# Altium schematic sheet Controller_1.SchDoc
size A3
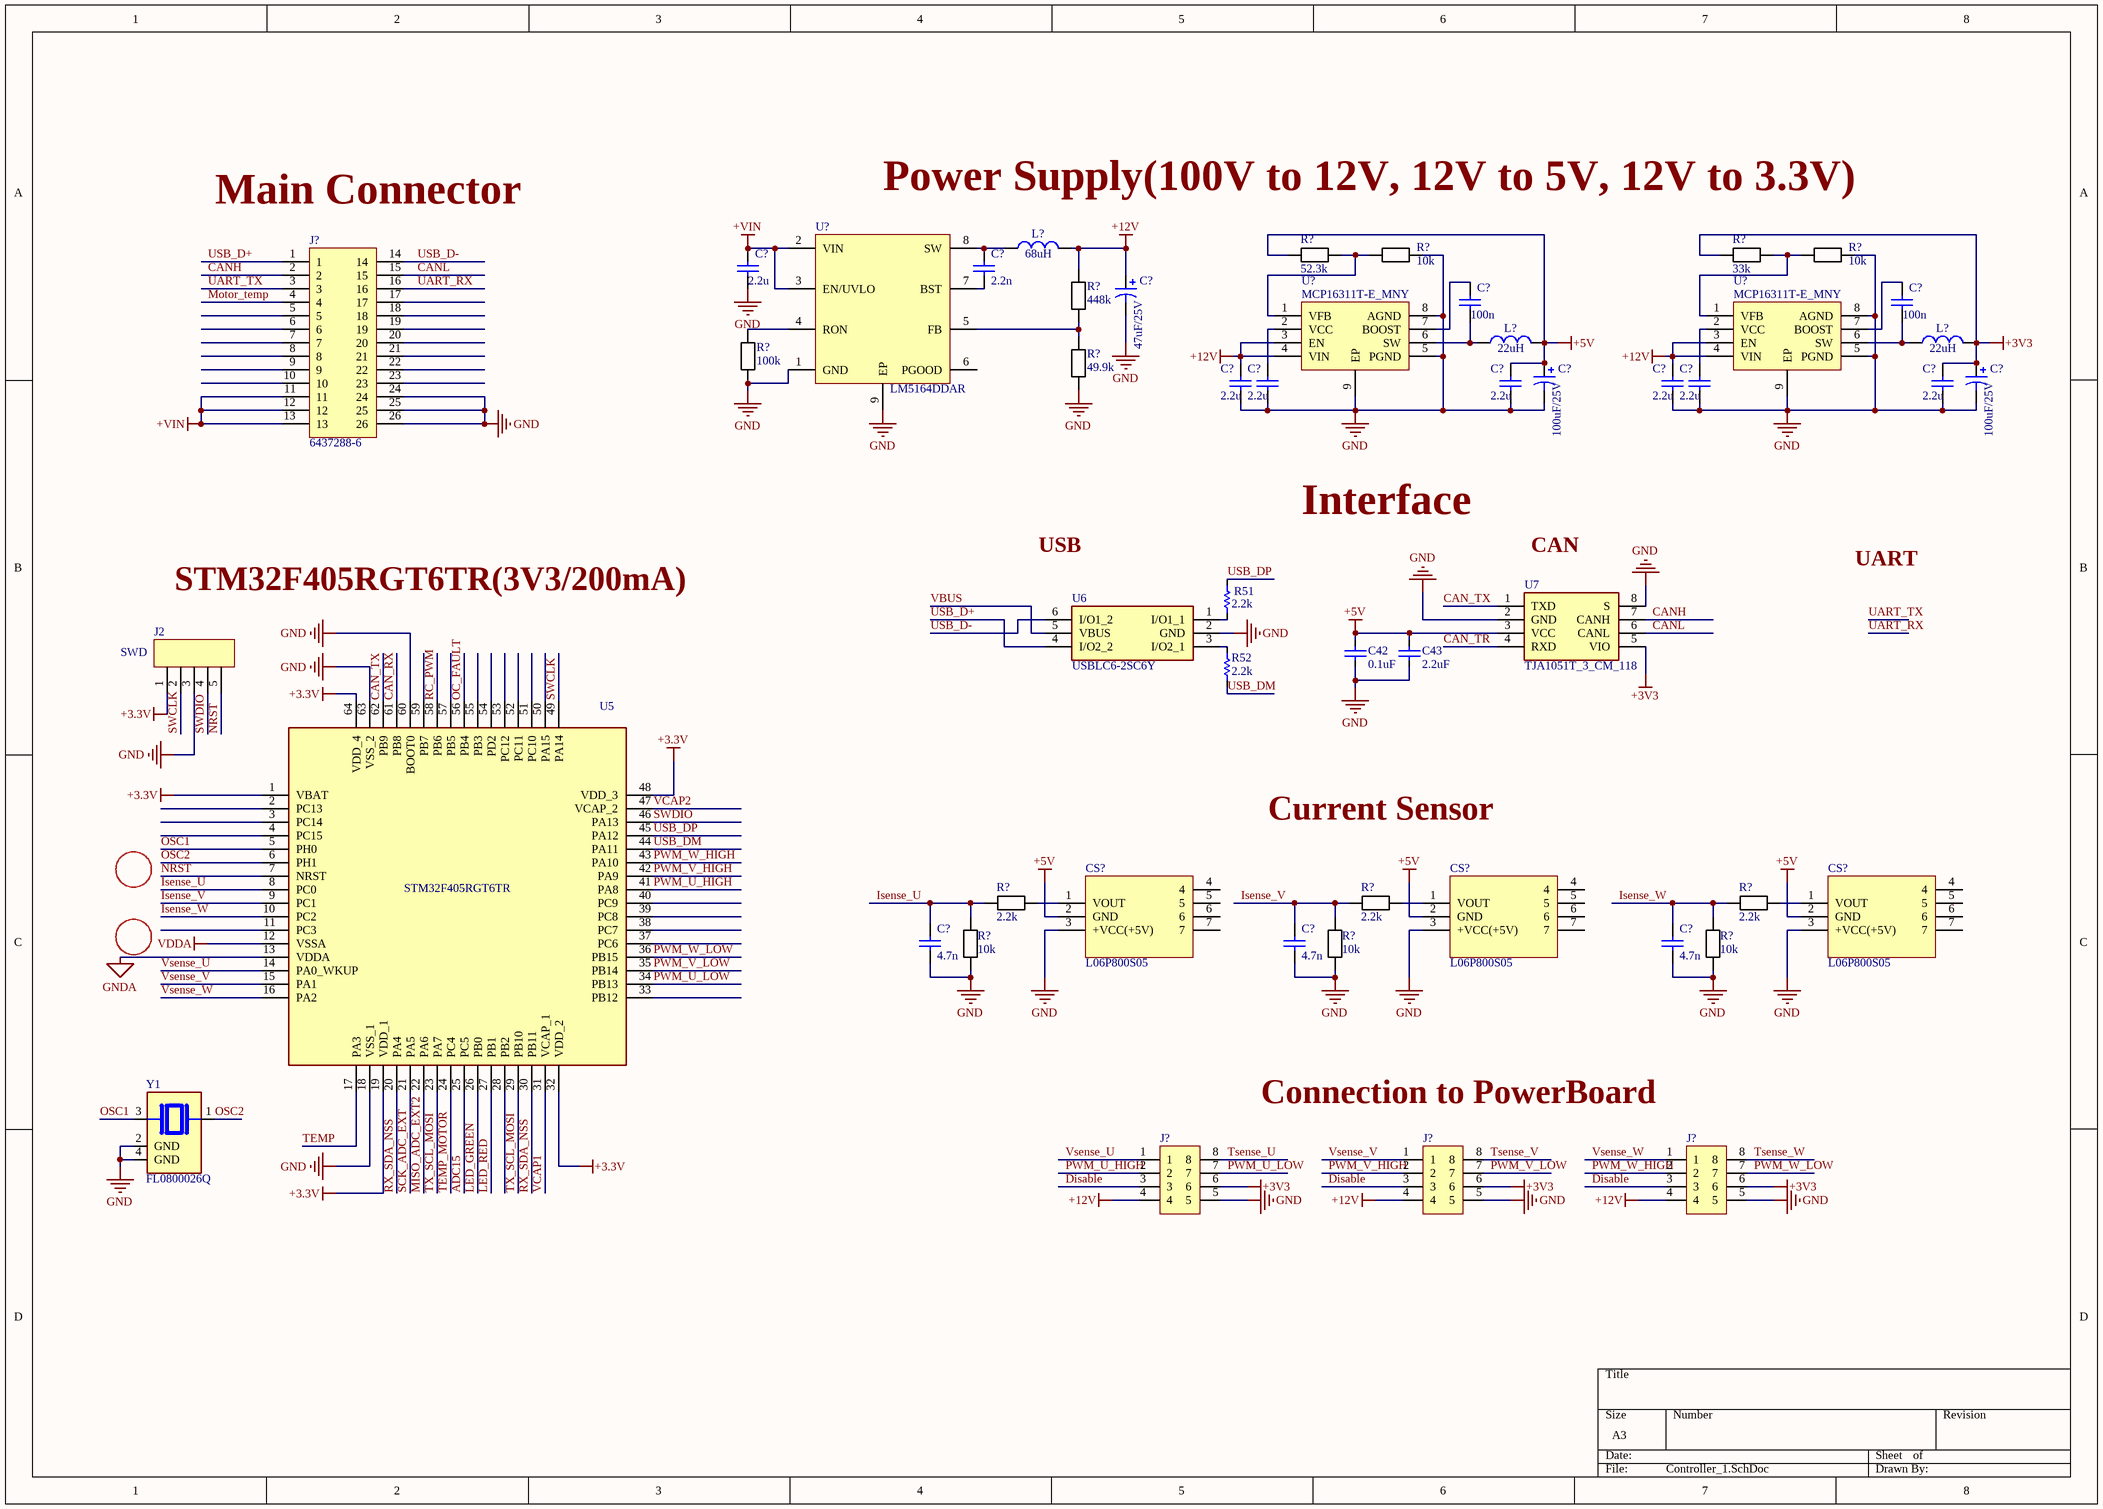
[diagram p0: Controller_1.SchDoc]

## Parts
(Parts that share a designator on the sheet are numbered #1, #2 ... from top to bottom, then left to right.)
C42  0.1uF  [SMD_C(0402)]
C43  2.2uF  [SMD_C(0603)]
C?#1  2.2u  [*]
C?#2  2.2n  [C0603]
C?#3  100n  [C0603]
C?#4  100n  [C0603]
C?#5  47uF/25V  [*]
C?#6  2.2u  [*]
C?#7  2.2u  [*]
C?#8  2.2u  [*]
C?#9  2.2u  [*]
C?#10  2.2u  [*]
C?#11  2.2u  [*]
C?#12  100uF/25V  [*]
C?#13  100uF/25V  [*]
C?#14  4.7n  [C0603]
C?#15  4.7n  [C0603]
C?#16  4.7n  [C0603]
CS?#1  L06P800S05  [L06P800S05]
CS?#2  L06P800S05  [L06P800S05]
CS?#3  L06P800S05  [L06P800S05]
J2  SWD  [Header-2.54m-5pin]
J?#1  6437288-6  [64372886]
J?#2  (no value)  [*]
J?#3  (no value)  [*]
J?#4  (no value)  [*]
L?#1  68uH  [*]
L?#2  22uH  [*]
L?#3  22uH  [*]
R51  2.2k  [SMD_R(0402)]
R52  2.2k  [SMD_R(0402)]
R?#1  52.3k  [R0603]
R?#2  33k  [R0603]
R?#3  448k  [R0603]
R?#4  10k  [R0603]
R?#5  10k  [R0603]
R?#6  100k  [R0603]
R?#7  49.9k  [R0603]
R?#8  2.2k  [R0603]
R?#9  2.2k  [R0603]
R?#10  2.2k  [R0603]
R?#11  10k  [R0603]
R?#12  10k  [R0603]
R?#13  10k  [R0603]
U5  STM32F405RGT6TR  [QFP50P1200X1200X160-64N]
U6  USBLC6-2SC6Y  [SOT95P280X145-6N]
U7  TJA1051T_3_CM_118  [SOIC127P600X175-8N]
U?#1  MCP16311T-E_MNY  [MSOP-8]
U?#2  MCP16311T-E_MNY  [MSOP-8]
U?#3  LM5164DDAR  [SOIC-8(EPAD)]
Y1  FL0800026Q  [XTAL_FL0800026Q]

## Nets
+3.3V: J2.1 U5.1(VBAT) U5.19(VDD_1) U5.32(VDD_2) U5.48(VDD_3) U5.64(VDD_4)
+3V3: C?#11.2 C?#13.1 J?#2.6 J?#3.6 J?#4.6 L?#3.2 R?#2.1 U7.5(VIO)
+5V: C42.2 C43.2 C?#8.2 C?#12.1 CS?#1.2(GND) CS?#2.2(GND) CS?#3.2(GND) L?#2.2 R?#1.1 U7.3(VCC)
+12V: C?#5.1 C?#6.2 C?#9.2 J?#2.4 J?#3.4 J?#4.4 L?#1.2 R?#3.2 U?#1.3(EN) U?#1.4(VIN) U?#2.3(EN) U?#2.4(VIN)
+VIN: C?#1.2 J?#1.11 J?#1.12 J?#1.13 U?#3.2(VIN) U?#3.3(EN/UVLO)
GND: C42.1 C43.1 C?#1.1 C?#5.2 C?#6.1 C?#7.1 C?#8.1 C?#9.1 C?#10.1 C?#11.1 C?#12.2 C?#13.2 C?#14.1 C?#15.1 C?#16.1 CS?#1.3(+VCC(+5V)) CS?#2.3(+VCC(+5V)) CS?#3.3(+VCC(+5V)) J2.3 J?#1.24 J?#1.25 J?#1.26 J?#2.5 J?#3.5 J?#4.5 R?#4.1 R?#5.1 R?#6.1 R?#7.1 R?#11.1 R?#12.1 R?#13.1 U5.18(VSS_1) U5.60(BOOT0) U5.63(VSS_2) U6.2(GND) U7.2(GND) U7.8(S) U?#1.5(PGND) U?#1.8(AGND) U?#1.9(EP) U?#2.5(PGND) U?#2.8(AGND) U?#2.9(EP) U?#3.1(GND) U?#3.9(EP) Y1.2(GND) Y1.4(GND)
GNDA: U5.13(VDDA)
VDDA: U5.12(VSSA)
ADC15: U5.25(PC5)
CAN_RX: U5.61(PB8)
CAN_TR: U7.4(RXD)
CAN_TX: U5.62(PB9) U7.1(TXD)
CANH: J?#1.2 U7.7(CANH)
CANL: J?#1.15 U7.6(CANL)
Disable: J?#2.3 J?#3.3 J?#4.3
Isense_U: C?#14.2 R?#8.1 R?#11.2 U5.8(PC0)
Isense_V: C?#15.2 R?#9.1 R?#12.2 U5.9(PC1)
Isense_W: C?#16.2 R?#10.1 R?#13.2 U5.10(PC2)
LED_GREEN: U5.26(PB0)
LED_RED: U5.27(PB1)
MISO_ADC_EXT2: U5.22(PA6)
Motor_temp: J?#1.4
NRST: J2.5 U5.7(NRST)
OC_FAULT: U5.56(PB4)
OSC1: U5.5(PH0) Y1.3
OSC2: U5.6(PH1) Y1.1
PWM_U_HIGH: J?#2.2 U5.41(PA8)
PWM_U_LOW: J?#2.7 U5.34(PB13)
PWM_V_HIGH: J?#3.2 U5.42(PA9)
PWM_V_LOW: J?#3.7 U5.35(PB14)
PWM_W_HIGH: J?#4.2 U5.43(PA10)
PWM_W_LOW: J?#4.7 U5.36(PB15)
RC_PWM: U5.58(PB6)
RX_SDA_NSS: U5.20(PA4) U5.30(PB11)
SCK_ADC_EXT: U5.21(PA5)
SWCLK: J2.2 U5.49(PA14)
SWDIO: J2.4 U5.46(PA13)
TEMP: U5.17(PA3)
TEMP_MOTOR: U5.24(PC4)
Tsense_U: J?#2.8
Tsense_V: J?#3.8
Tsense_W: J?#4.8
TX_SCL_MOSI: U5.23(PA7) U5.29(PB10)
UART_RX: J?#1.16
UART_TX: J?#1.3
USB_D+: J?#1.1 U6.4(I/O2_2)
USB_D-: J?#1.14 U6.6(I/O1_2)
USB_DM: R52.2 U5.44(PA11)
USB_DP: R51.2 U5.45(PA12)
VBUS: U6.5(VBUS)
VCAP1: U5.31(VCAP_1)
VCAP2: U5.47(VCAP_2)
Vsense_U: J?#2.1 U5.14(PA0_WKUP)
Vsense_V: J?#3.1 U5.15(PA1)
Vsense_W: J?#4.1 U5.16(PA2)
NetC?#2_1: C?#2.1 U?#3.7(BST)
NetC?#2_2: C?#2.2 L?#1.1 U?#3.8(SW)
NetC?#3_1: C?#3.1 L?#2.1 U?#1.6(SW)
NetC?#3_2: C?#3.2 U?#1.7(BOOST)
NetC?#4_1: C?#4.1 L?#3.1 U?#2.6(SW)
NetC?#4_2: C?#4.2 U?#2.7(BOOST)
NetC?#7_2: C?#7.2 U?#1.2(VCC)
NetC?#10_2: C?#10.2 U?#2.2(VCC)
NetCS?#1_1: CS?#1.1(VOUT) R?#8.2
NetCS?#2_1: CS?#2.1(VOUT) R?#9.2
NetCS?#3_1: CS?#3.1(VOUT) R?#10.2
NetR51_1: R51.1 U6.1(I/O1_1)
NetR52_1: R52.1 U6.3(I/O2_1)
NetR?#1_2: R?#1.2 R?#4.2 U?#1.1(VFB)
NetR?#2_2: R?#2.2 R?#5.2 U?#2.1(VFB)
NetR?#3_1: R?#3.1 R?#7.2 U?#3.5(FB)
NetR?#6_2: R?#6.2 U?#3.4(RON)

Not connected (* = marked no-connect by the designer): CS?#1 4 5 6 7; CS?#2 4 5 6 7; CS?#3 4 5 6 7; J?#1 5 6 7 8 9 10 17 18 19 20 21 22 23; U5 2(PC13) 3(PC14) 4(PC15) 11(PC3) 28(PB2) 33(PB12) 37(PC6) 38(PC7) 39(PC8) 40(PC9) 50(PA15) 51(PC10) 52(PC11) 53(PC12) 54(PD2) 55(PB3) 57(PB5) 59(PB7); U?#3 6(PGOOD)

## Notes on the sheet
- (near J?#1) Main Connector
- Power Supply(100V to 12V, 12V to 5V, 12V to 3.3V)
- USB
- Interface
- (near U7) CAN
- UART
- STM32F405RGT6TR(3V3/200mA)
- Current Sensor
- (near J?#3) Connection to PowerBoard

## Library data of the parts
C42 = Cap_1: Multilayer Ceramic Capacitors MLCC - SMD/SMT 50 V 0.1uF X7R 0603 10%; Manufacturer: Yageo; Manufacturer Part Number: CC0603KPX7R9BB104; Supplier 1: Digi-Key; Supplier Part Number 1: 311-3567-1-ND
C43 = Cap_4: Multilayer Ceramic Capacitors MLCC - SMD/SMT 2.2 uF 50 VDC 10% 1206 X7R AEC-Q200; Manufacturer: Yageo; Manufacturer Part Number: GCM31CR71H225KA55K; Supplier 1: Digi-Key; Supplier Part Number 1: 311-3567-1-ND
C?#1 = 2.2uF ± 10% 100V: Value: 2.2u
C?#2 = 2.2nF ± 10% 50V: Manufacturer: Yageo; Price: 0.1; Supplier: Mouser; Value: 2.2n
C?#3 C?#4 = 100nF ± 10% 50V: Manufacturer: Yageo; Manufacturer Part Number: CC0603KRX7R9BB104; Supplier Part Number: 603-CC603KRX7R9BB104; Price: 0.1; Supplier: Mouser; Value: 100n
C?#5 = Cap Pol1: 47uF ±20% 25V; Value: 47uF/25V
C?#6-C?#11 = 2.2uF ± 10% 25V: Value: 2.2u
C?#12 C?#13 = Cap Pol1: 100uF ±20% 25V; Value: 100uF/25V
C?#14-C?#16 = 4.7nF ± 10% 50V: Manufacturer: Yageo; Price: 0.1; Supplier: Mouser; Value: 4.7n
CS?#1-CS?#3 = L06P800S05: Board Mount Current Sensors Current Sensor, +/-800A, +5VDC, PCB, Open Loop, Aperture, 2.5V+/-1.5V Output; Manufacturer: Tamura; Supplier Part Number: 838-L06P800S05; Price: 20; Manufacturer Part Number: L06P800S05; Value: L06P800S05; Supplier: Mouser
J2 = 5PinConnector
J?#1 = 6437288-6: Header vert 26 way 4 row Tab Superseal; Manufacturer: TE Connectivity; Supplier Part Number: 571-6437288-6; Manufacturer Part Number: 6437288-6; Supplier: Mouser; Value: 6437288-6
J?#2-J?#4 = PCB Header: 2 Row 2.54mm Pitch 8 pins
L?#1-L?#3 = Inductor
  L?#1: Value: 68uH
  L?#2 L?#3: Value: 22uH
R51 R52 = Res Semi_2: CRCW04024R02FKED; Published: 8-Jun-2000; LatestRevisionDate: 17-Jul-2002; LatestRevisionNote: Re-released for DXP Platform.; PackageReference: AXIAL-0.5; Publisher: Altium Limited; PackageDescription: Axial Device, Thru-Hole; 2 Leads; 0.5 in Pin Spacing
R?#1 = 52.3 kohm 0.1W ±1%: Manufacturer Part Number: RC0603FR-0752K3L; Manufacturer: Yageo; Value: 52.3k; Supplier: Mouser; Supplier Part Number: 603-RC0603FR-0752K3L; Price: 0.1
R?#2 = 33 kohm 0.1W ±1%: Manufacturer Part Number: RC0603FR-0733KL; Manufacturer: Yageo; Value: 33k; Supplier: Mouser; Supplier Part Number: 603-RC0603FR-0733KL; Price: 0.1
R?#3 = 448 kohm 0.1W ±1%: Manufacturer Part Number: RC0603FR-07448KL; Manufacturer: Yageo; Value: 448k; Supplier: Mouser; Supplier Part Number: 603-RC0603FR-07448KL; Price: 0.1
R?#4 R?#5 R?#11-R?#13 = 10 kohm 0.1W ±1%: Manufacturer Part Number: RC0603FR-0710KL; Manufacturer: Yageo; Value: 10k; Supplier: Mouser; Supplier Part Number: 603-RC0603FR-0710KL; Price: 0.1
R?#6 = 100 kohm 0.1W ±1%: Manufacturer Part Number: RC0603FR-07100KL; Manufacturer: Yageo; Value: 100k; Supplier: Mouser; Supplier Part Number: 603-RC0603FR-07100KL; Price: 0.1
R?#7 = 49.9 kohm 0.1W ±1%: Manufacturer Part Number: RC0603FR-0749K9L; Manufacturer: Yageo; Value: 49.9k; Supplier: Mouser; Supplier Part Number: 603-RC0603FR-0749K9L; Price: 0.1
R?#8-R?#10 = 2.2 kohm 0.1W ±1%: Manufacturer Part Number: RC0603FR-072K2L; Manufacturer: Yageo; Value: 2.2k; Supplier: Mouser; Supplier Part Number: 603-RC0603FR-072K2L; Price: 0.1
U5 = STM32F405RGT6TR: STM32F405RGT6TR, 32 bit ARM Cortex M4 MCU 168MHz 1024 kB Flash, 192 kB RAM, 2xUSB CAN I2C 64-Pin LQFP; Manufacturer_Name: STMicroelectronics; Geometry.Height: 1.6mm; Mouser Part Number: 511-STM32F405RGT6TR; Mouser Price/Stock: https://www.mouser.co.uk/ProductDetail/STMicroelectronics/STM32F405RGT6TR?qs=MavH1QghrkHshpR6GkvPIg%3D%3D; Manufacturer_Part_Number: STM32F405RGT6TR; Datasheet Link: http://www.st.com/web/en/resource/technical/document/datasheet/DM00037051.pdf
U6 = USBLC6-2SC6Y: Low Cap. ESD Protection Auto SOT-23-6 STMicroelectronics USBLC6-2SC6Y, Dual Uni-Directional TVS Diode Array, 6-Pin SOT-23; Geometry.Height: 1.45mm; Mouser Part Number: 511-USBLC6-2SC6Y; Mouser Price/Stock: https://www.mouser.co.uk/ProductDetail/STMicroelectronics/USBLC6-2SC6Y?qs=gNDSiZmRJS%2FOgDexvXkdow%3D%3D; Manufacturer_Name: STMicroelectronics; Manufacturer_Part_Number: USBLC6-2SC6Y; Datasheet Link: https://componentsearchengine.com/Datasheets/1/USBLC6-2SC6Y.pdf
U7 = TJA1051T_3_CM_118: CAN Interface IC BL Advanced Automotive Analog; Manufacturer_Name: NXP; Manufacturer_Part_Number: TJA1051T/3/CM,118; Geometry.Height: 1.75mm; Mouser Part Number: 771-TJA1051T/3CM118; Mouser Price/Stock: https://www.mouser.co.uk/ProductDetail/NXP-Semiconductors/TJA1051T-3-CM118?qs=5XOdhvmYM0NUkmo%252BpXvJfw%3D%3D; Datasheet Link: http://www.nxp.com/docs/en/data-sheet/TJA1051.pdf
U?#1 U?#2 = MCP16311T-E_MNY: Microchip, MCP16311T-E/MNY Step Down DC-DC Converter 1A Adjustable, 2  24 V 8-Pin, TDFN; Supplier Part Number: 579-MCP16311T-E/MNY; Price: 1.8; Manufacturer: Microchip; Manufacturer Part Number: MCP16311T-E/MNY; Value: MCP16311T-E/MNY; Supplier: Mouser
U?#3 = LM5164DDAR: Texas Instruments 6-V to 100-V Input, 1-A Synchronous Buck DC-DC Converter With Ultra-Low IQ 8-SO PowerPAD -40 to 150; Value: 1.7mm; Supplier Part Number: 595-LM5164DDAR; Price: 3.5; Manufacturer: Texas Instruments; Manufacturer Part Number: LM5164DDAR; Supplier: Mouser
Y1 = FL0800026Q: 8 MHz Â±30ppm Crystal 8pF 400 Ohms 4-SMD, No Lead; MF: Diodes Incorporated; Package: NON STANDARD-4 Diodes Inc.; Price: None; Check_prices: https://www.snapeda.com/parts/FL0800026Q/Diodes+Inc./view-part/?ref=eda; Value: *; SnapEDA_Link: https://www.snapeda.com/parts/FL0800026Q/Diodes+Inc./view-part/?ref=snap; MP: FL0800026Q; Availability: In Stock; Purchase-URL: https://pricing.snapeda.com/search?q=FL0800026Q&ref=eda